# EAGLE schematic NodeRelay.v1.cg2 (EAGLE 4.16)
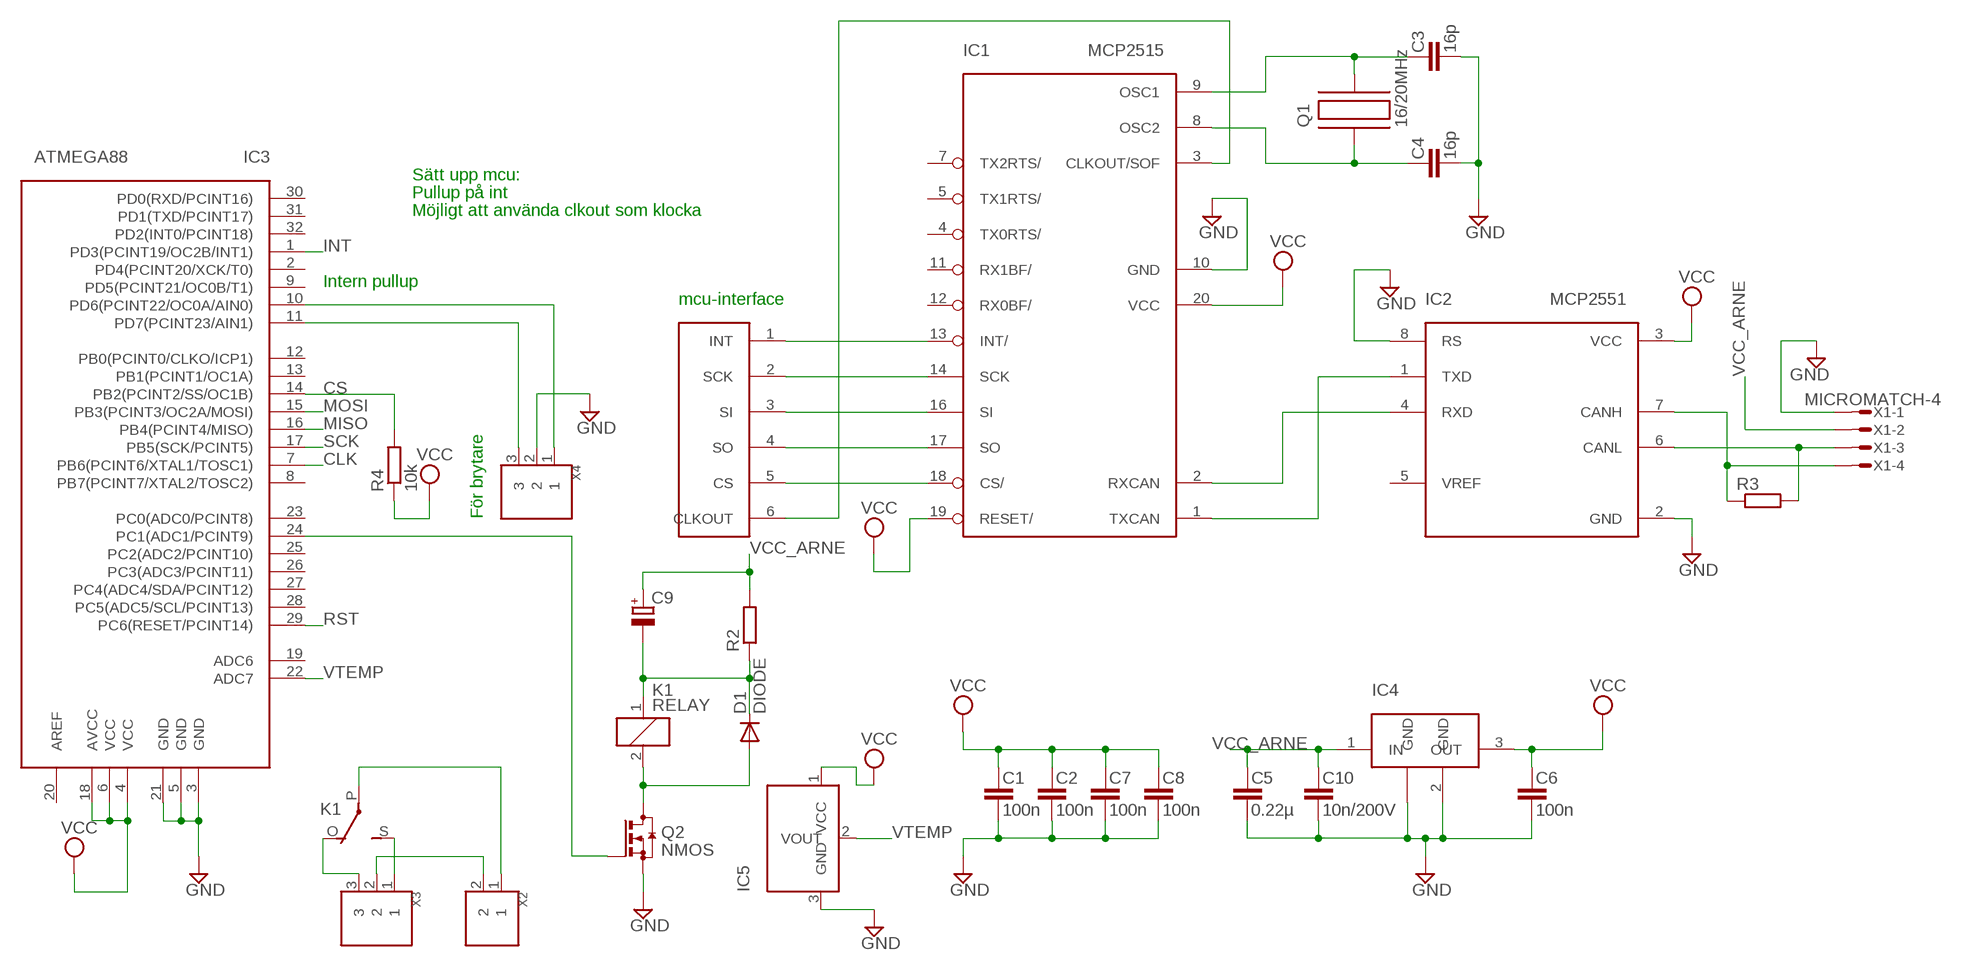
[diagram p0: schematic, sheet 1]

## Parts
C1  100n  C-EU  [C0603]
C2  100n  C-EU  [C0603]
C3  16p  C-EU  [C0603]
C4  16p  C-EU  [C0603]
C5  0.22µ  C-EU  [C0603]
C6  100n  C-EU  [C0603]
C7  100n  C-EU  [C0603]
C8  100n  C-EU  [C0603]
C9  CPOL-EU  [153CLV-0807]
C10  10n/200V  C-EU  [C0603]
D1  DIODE  [SOT23]
IC1  MCP2515  [TSSOP]
IC2  MCP2551  [SOIC]
IC3  ATMEGA88  [TQFP32]
IC4  LM340MP-5.0  [SOT223]
IC5  TC1047A  [SOT23]
K1  RELAY  [TYCO-PCH]
Q1  16/20MHz  C-MAC-LFA147E  [SMD]
Q2  NMOS  [SOT23]
R2  R-EU_R0805  [R0805@1]
R3  R-EUR0603  [R0603]
R4  10k  R-EUR0603  [R0603]
U$1  CAN-INTERFACE  [VIA-LIST]
X1  MICROMATCH-4  [MICROMATCH-4]
X2  BLOCK2  [PCB2]
X3  BLOCK3  [PCB3]
X4  BLOCK3  [PCB3]

## Nets
CANH: IC2.7(CANH) R3.1 X1.4
CLK: IC1.3(CLKOUT/SOF) IC3.7(PB6(PCINT6/XTAL1/TOSC1)) U$1.6(CLKOUT)
CS: IC1.18(CS/) IC3.14(PB2(PCINT2/SS/OC1B)) R4.2 U$1.5(CS)
GND: C1.2 C2.2 C3.2 C4.2 C5.2 C6.2 C7.2 C8.2 C10.2 IC1.10(GND) IC2.2(GND) IC2.8(RS) IC3.3(GND) IC3.5(GND) IC3.21(GND) IC4.2(GND) IC4.4(GND) IC5.3(GND) Q2.2(S) X1.1 X4.2
INT: IC1.13(INT/) IC3.1(PD3(PCINT19/OC2B/INT1)) U$1.1(INT)
MISO: IC1.17(SO) IC3.16(PB4(PCINT4/MISO)) U$1.4(SO)
MOSI: IC1.16(SI) IC3.15(PB3(PCINT3/OC2A/MOSI)) U$1.3(SI)
N$1: IC1.2(RXCAN) IC2.4(RXD)
N$2: IC1.1(TXCAN) IC2.1(TXD)
N$3: X2.2 X3.2
N$5: K1.P(2:P) X2.1
N$6: K1.S(2:S) X3.1
N$7: K1.O(2:O) X3.3
N$8: C9.- D1.3(C) K1.1 R2.1
N$9: D1.1(A) K1.2 Q2.3(D)
N$11: IC3.11(PD7(PCINT23/AIN1)) X4.3
N$12: C3.1 IC1.9(OSC1) Q1.P$2
N$13: C4.1 IC1.8(OSC2) Q1.P$1
N$14: IC3.24(PC1(ADC1/PCINT9)) Q2.1(G)
N$15: IC3.10(PD6(PCINT22/OC0A/AIN0)) X4.1
N$16: IC2.6(CANL) R3.2 X1.3
RST: IC3.29(PC6(RESET/PCINT14))
SCK: IC1.14(SCK) IC3.17(PB5(SCK/PCINT5)) U$1.2(SCK)
VCC: C1.1 C2.1 C6.1 C7.1 C8.1 IC1.19(RESET/) IC1.20(VCC) IC2.3(VCC) IC3.4(VCC) IC3.6(VCC) IC3.18(AVCC) IC4.3(OUT) IC5.1(VCC) R4.1
VCC_ARNE: C5.1 C9.+ C10.1 IC4.1(IN) R2.2 X1.2
VTEMP: IC3.22(ADC7) IC5.2(VOUT)
Unconnected: IC1.4(TX0RTS/) IC1.5(TX1RTS/) IC1.7(TX2RTS/) IC1.11(RX1BF/) IC1.12(RX0BF/) IC2.5(VREF) IC3.2(PD4(PCINT20/XCK/T0)) IC3.8(PB7(PCINT7/XTAL2/TOSC2)) IC3.9(PD5(PCINT21/OC0B/T1)) IC3.12(PB0(PCINT0/CLKO/ICP1)) IC3.13(PB1(PCINT1/OC1A)) IC3.19(ADC6) IC3.20(AREF) IC3.23(PC0(ADC0/PCINT8)) IC3.25(PC2(ADC2/PCINT10)) IC3.26(PC3(ADC3/PCINT11)) IC3.27(PC4(ADC4/SDA/PCINT12)) IC3.28(PC5(ADC5/SCL/PCINT13)) IC3.30(PD0(RXD/PCINT16)) IC3.31(PD1(TXD/PCINT17)) IC3.32(PD2(INT0/PCINT18))

## Notes on the sheet
- Sätt upp mcu:
- Pullup på int
- Möjligt att använda clkout som klocka
- Intern pullup
- mcu-interface
- För brytare

## Library data of the parts
C1-C8 C10 = rcl:C-EU
C9 = rcl:CPOL-EU
D1 = diode:DIODE: DIODE ultra fast rectifier, 3 A
IC1 = mcp2515:MCP2515
IC2 = mcp2551:MCP2551
IC3 = atmega88:ATMEGA88
IC4 = lm340mp:LM340MP-5.0
IC5 = tc1047a:TC1047A
K1 = relay:RELAY: RELAY 1 x switch, Omron
Q1 = hc49-4h-smx:C-MAC-LFA147E
Q2 = transistor:NMOS
R2 = rcl:R-EU_: RESISTOR, European symbol
R3 R4 = rcl:R-EU
U$1 = can-interface:CAN-INTERFACE
X1 = con-amp-micromatch:MICROMATCH-4: MicroMaTch 4 7-215464-4 / 0-215464-4 Drawing Number C-215464 DDEController.pdf
X2 = terminal_block:BLOCK2
X3 X4 = terminal_block:BLOCK3